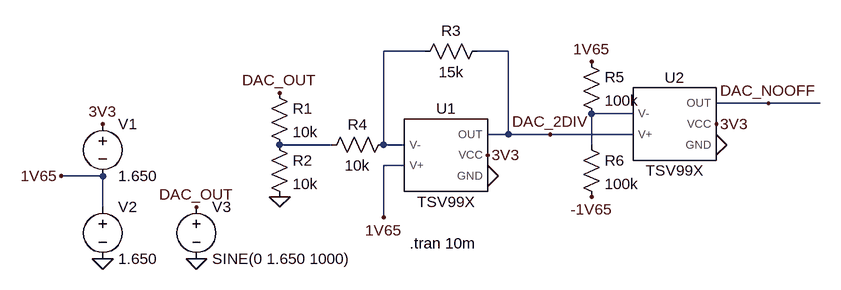
[diagram p0: schematic Voltage divider TSV991.asc]
Voltage divider TSV991.asc, the LTspice schematic file:
Version 4
SHEET 1 1252 680
WIRE 624 48 560 48
WIRE 752 48 704 48
WIRE 1152 128 1072 128
WIRE 1232 128 1152 128
WIRE 944 144 880 144
WIRE 752 176 752 48
WIRE 752 176 720 176
WIRE 816 176 752 176
WIRE 944 176 816 176
WIRE 480 192 400 192
WIRE 560 192 560 48
WIRE 592 192 560 192
WIRE 880 192 880 144
WIRE 592 224 560 224
WIRE 128 240 64 240
WIRE 128 288 128 240
WIRE 560 304 560 224
FLAG 128 368 0
FLAG 128 160 3V3
FLAG 64 240 1V65
FLAG 272 368 0
FLAG 272 288 DAC_OUT
FLAG 400 112 DAC_OUT
FLAG 816 176 DAC_2DIV
FLAG 880 64 1V65
FLAG 880 272 -1V65
FLAG 1152 128 DAC_NOOFF
FLAG 560 304 1V65
FLAG 400 272 0
FLAG 720 208 3V3
FLAG 1072 160 3V3
FLAG 720 240 0
FLAG 1072 192 0
SYMBOL voltage 128 144 R0
WINDOW 123 0 0 Left 2
WINDOW 39 0 0 Left 2
SYMATTR InstName V1
SYMATTR Value 1.650
SYMBOL voltage 128 272 R0
WINDOW 123 0 0 Left 2
WINDOW 39 0 0 Left 2
SYMATTR InstName V2
SYMATTR Value 1.650
SYMBOL AutoGenerated\\TSV99X 656 208 R0
SYMATTR InstName U1
SYMBOL voltage 272 272 R0
WINDOW 123 0 0 Left 2
WINDOW 39 0 0 Left 2
SYMATTR InstName V3
SYMATTR Value SINE(0 1.650 1000)
SYMBOL res 384 96 R0
SYMATTR InstName R1
SYMATTR Value 10k
SYMBOL res 384 176 R0
SYMATTR InstName R2
SYMATTR Value 10k
SYMBOL res 608 64 R270
WINDOW 0 32 56 VTop 2
WINDOW 3 0 56 VBottom 2
SYMATTR InstName R3
SYMATTR Value 15k
SYMBOL res 576 176 R90
WINDOW 0 0 56 VBottom 2
WINDOW 3 32 56 VTop 2
SYMATTR InstName R4
SYMATTR Value 10k
SYMBOL AutoGenerated\\TSV99X 1008 160 R0
SYMATTR InstName U2
SYMBOL res 864 48 R0
SYMATTR InstName R5
SYMATTR Value 100k
SYMBOL res 864 176 R0
SYMATTR InstName R6
SYMATTR Value 100k
TEXT 600 344 Left 2 !.tran 10m

The netlist it stands for:
* Voltage divider TSV991.asc
V1 3V3 1V65 1.650
V2 1V65 0 1.650
XU1 N001 1V65 DAC_2DIV 3V3 0 TSV99X  ; pins V- V+ OUT VCC GND
V3 DAC_OUT 0 SINE(0 1.650 1000)
R1 DAC_OUT N003 10k
R2 N003 0 10k
R3 N001 DAC_2DIV 15k
R4 N001 N003 10k
XU2 N002 DAC_2DIV DAC_NOOFF 3V3 0 TSV99X  ; pins V- V+ OUT VCC GND
R5 1V65 N002 100k
R6 N002 -1V65 100k
.tran 10m
.lib D:\Github\LTSpice\LTS0000 - Models\TSX631.mod
.backanno
.end